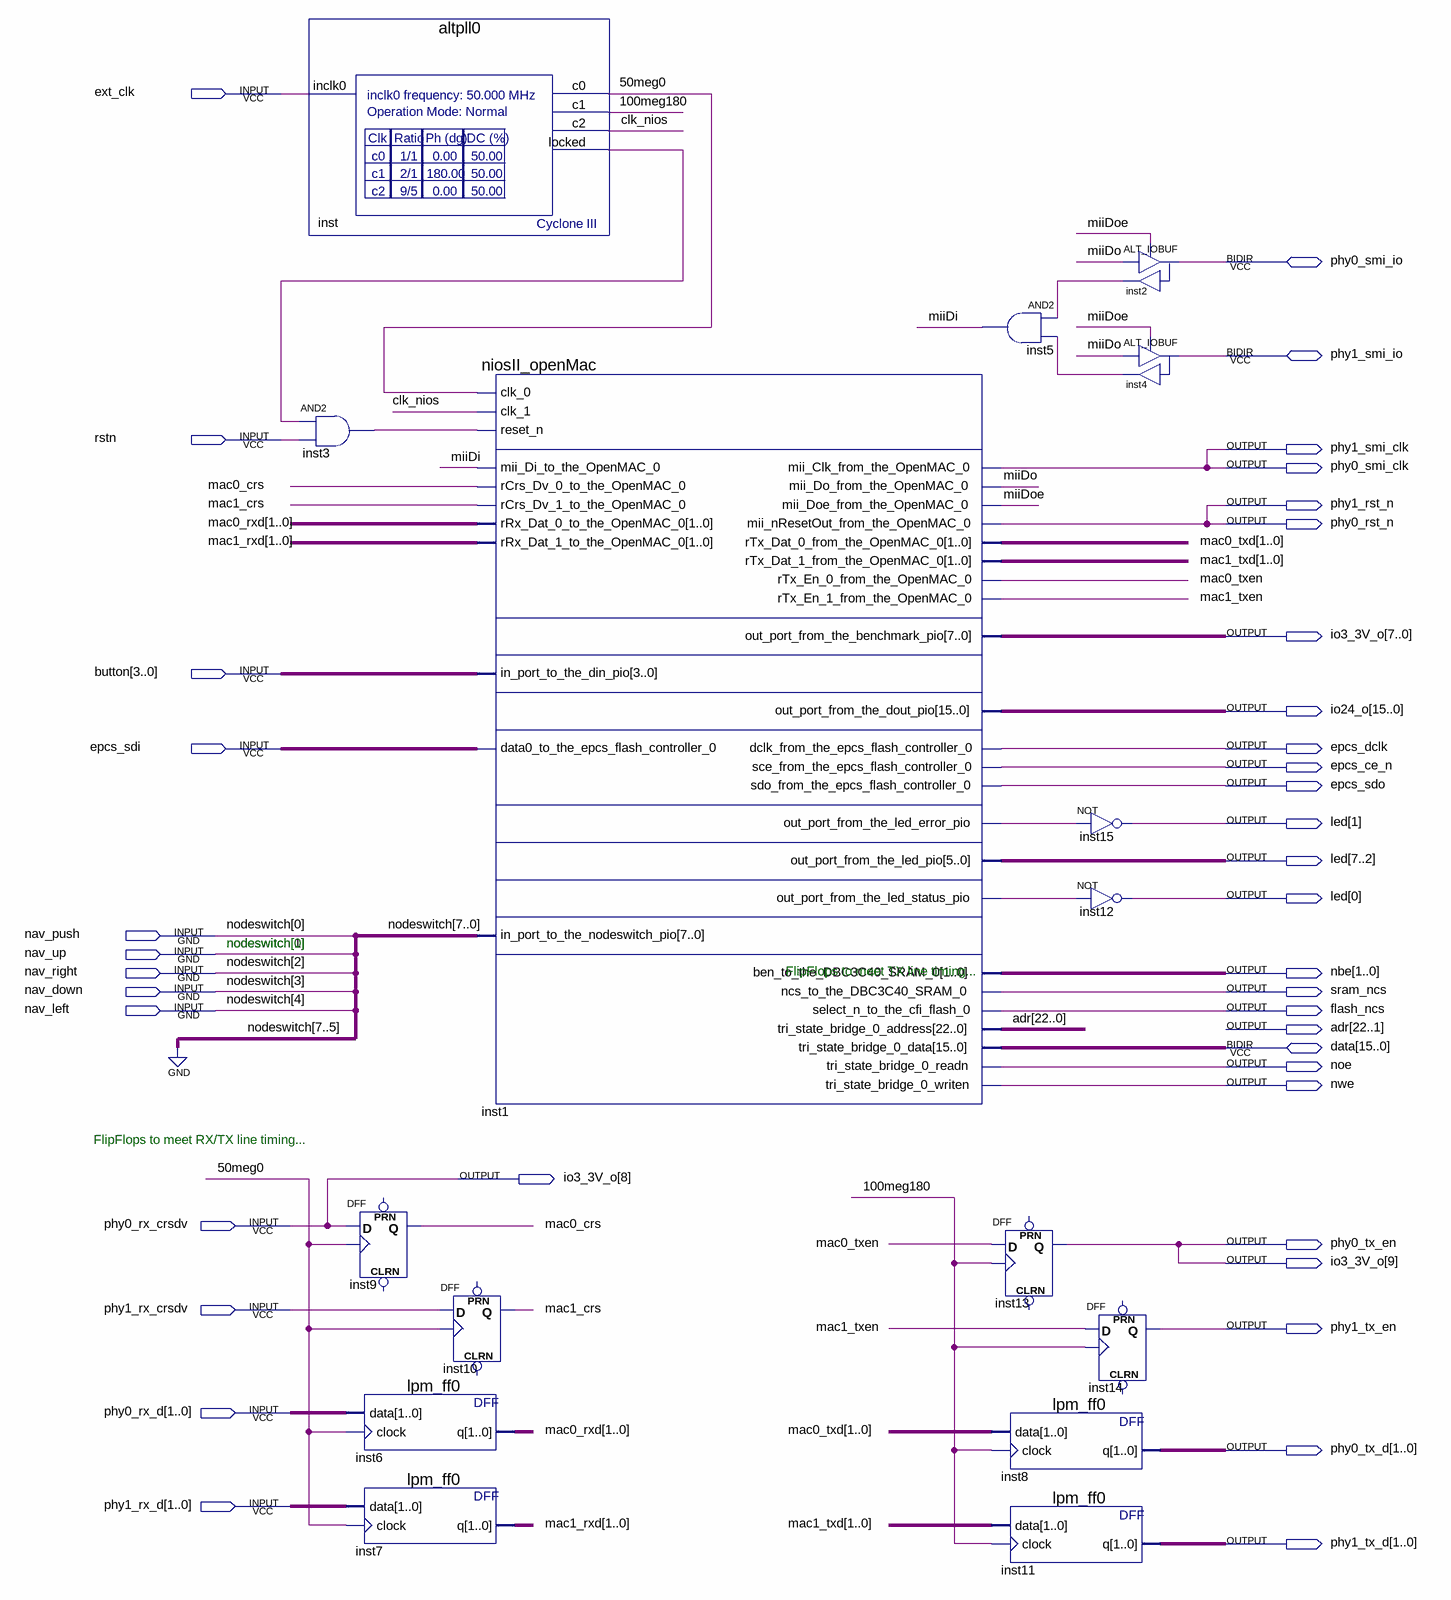
[diagram p0: schematic sheet]
// Quartus schematic nios_pll.bdf as structural Verilog: 16 symbols, 40 pins
module nios_pll (
  input  ext_clk,
  input  rstn,
  input  [3:0] button,
  input  epcs_sdi,
  input  nav_push,
  input  nav_up,
  input  nav_right,
  input  nav_down,
  input  nav_left,
  input  phy0_rx_crsdv,
  input  phy1_rx_crsdv,
  input  [1:0] phy0_rx_d,
  input  [1:0] phy1_rx_d,
  inout  phy0_smi_io,
  inout  phy1_smi_io,
  inout  [15:0] data,
  output phy1_smi_clk,
  output phy0_smi_clk,
  output phy1_rst_n,
  output phy0_rst_n,
  output [9:0] io3_3V_o,
  output [15:0] io24_o,
  output epcs_dclk,
  output epcs_ce_n,
  output epcs_sdo,
  output [7:0] led,
  output [1:0] nbe,
  output sram_ncs,
  output flash_ncs,
  output [22:0] adr,
  output noe,
  output nwe,
  output phy0_tx_en,
  output phy1_tx_en,
  output [1:0] phy0_tx_d,
  output [1:0] phy1_tx_d
);

  wire \50meg0 , \100meg180 , clk_nios, inst1_out_port_from_the_led_error_pio,
       inst1_out_port_from_the_led_status_pio, inst2_o, inst3_out, inst4_o, inst_locked, mac0_crs, mac0_txen,
       mac1_crs, mac1_txen, miiDi, miiDo, miiDoe;
  wire [1:0] mac0_rxd, mac0_txd, mac1_rxd, mac1_txd;

  altpll0 inst (.inclk0(ext_clk), .c0(\50meg0 ), .c1(\100meg180 ), .c2(clk_nios), .locked(inst_locked));
  and inst3 (inst3_out, inst_locked, rstn);
  DFF inst9 (.CLK(\50meg0 ), .D(phy0_rx_crsdv), .Q(mac0_crs));  // open: CLRN, PRN
  lpm_ff0 inst6 (.data(phy0_rx_d), .clock(\50meg0 ), .q(mac0_rxd));
  lpm_ff0 inst7 (.data(phy1_rx_d), .clock(\50meg0 ), .q(mac1_rxd));
  niosII_openMac inst1 (
    .clk_0(\50meg0 ), .clk_1(clk_nios), .reset_n(inst3_out), .mii_Di_to_the_OpenMAC_0(miiDi),
    .rCrs_Dv_0_to_the_OpenMAC_0(mac0_crs), .rCrs_Dv_1_to_the_OpenMAC_0(mac1_crs),
    .rRx_Dat_0_to_the_OpenMAC_0(mac0_rxd), .rRx_Dat_1_to_the_OpenMAC_0(mac1_rxd),
    .in_port_to_the_din_pio(button), .data0_to_the_epcs_flash_controller_0(epcs_sdi),
    .in_port_to_the_nodeswitch_pio({3'b000, nav_left, nav_down, nav_right, nav_up, nav_push}),
    .mii_Clk_from_the_OpenMAC_0(phy0_smi_clk), .mii_Do_from_the_OpenMAC_0(miiDo),
    .mii_Doe_from_the_OpenMAC_0(miiDoe), .mii_nResetOut_from_the_OpenMAC_0(phy0_rst_n),
    .rTx_Dat_0_from_the_OpenMAC_0(mac0_txd), .rTx_Dat_1_from_the_OpenMAC_0(mac1_txd),
    .rTx_En_0_from_the_OpenMAC_0(mac0_txen), .rTx_En_1_from_the_OpenMAC_0(mac1_txen),
    .out_port_from_the_benchmark_pio(io3_3V_o[7:0]), .out_port_from_the_dout_pio(io24_o),
    .dclk_from_the_epcs_flash_controller_0(epcs_dclk), .sce_from_the_epcs_flash_controller_0(epcs_ce_n),
    .sdo_from_the_epcs_flash_controller_0(epcs_sdo),
    .out_port_from_the_led_error_pio(inst1_out_port_from_the_led_error_pio),
    .out_port_from_the_led_pio(led[7:2]),
    .out_port_from_the_led_status_pio(inst1_out_port_from_the_led_status_pio),
    .ben_to_the_DBC3C40_SRAM_0(nbe), .ncs_to_the_DBC3C40_SRAM_0(sram_ncs),
    .select_n_to_the_cfi_flash_0(flash_ncs), .tri_state_bridge_0_address(adr),
    .tri_state_bridge_0_readn(noe), .tri_state_bridge_0_writen(nwe), .tri_state_bridge_0_data(data));
  DFF inst10 (.CLK(\50meg0 ), .D(phy1_rx_crsdv), .Q(mac1_crs));  // open: CLRN, PRN
  and inst5 (miiDi, inst2_o, inst4_o);
  DFF inst13 (.CLK(\100meg180 ), .D(mac0_txen), .Q(io3_3V_o[9]));  // open: CLRN, PRN
  lpm_ff0 inst8 (.data(mac0_txd), .clock(\100meg180 ), .q(phy0_tx_d));
  lpm_ff0 inst11 (.data(mac1_txd), .clock(\100meg180 ), .q(phy1_tx_d));
  not inst15 (led[1], inst1_out_port_from_the_led_error_pio);
  not inst12 (led[0], inst1_out_port_from_the_led_status_pio);
  DFF inst14 (.CLK(\100meg180 ), .D(mac1_txen), .Q(phy1_tx_en));  // open: CLRN, PRN
  ALT_IOBUF inst2 (.i(miiDo), .oe(miiDoe), .o(inst2_o), .io(phy0_smi_io));
  ALT_IOBUF inst4 (.i(miiDo), .oe(miiDoe), .o(inst4_o), .io(phy1_smi_io));

  assign io3_3V_o[8] = phy0_rx_crsdv;
  assign phy0_tx_en = io3_3V_o[9];
  assign phy1_rst_n = phy0_rst_n;
  assign phy1_smi_clk = phy0_smi_clk;

  // Other names for the same wires on the sheet: nodeswitch[4:0] = {nav_left, nav_down, nav_right, nav_up, nav_push}

  // Notes on the sheet:
  //   nodeswitch[0]
  //   FlipFlops to meet TX line timing...
  //   FlipFlops to meet RX/TX line timing...
endmodule
